# Altium schematic sheet USB.SchDoc
size A4
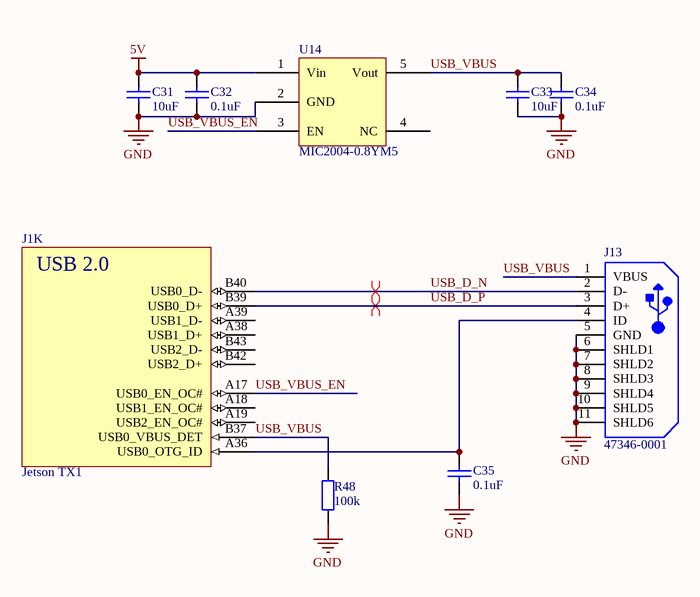
[diagram p0: USB.SchDoc]

## Parts
C31  value 10uF  [0603C_M]  (hidden comment: GRM188R60J106ME47D)
C32  Capacitance: 0.1uF  [0402C_M]  (hidden comment: GRM155R71C104KA88D)
C33  value 10uF  [0603C_M]  (hidden comment: GRM188R60J106ME47D)
C34  Capacitance: 0.1uF  [0402C_M]  (hidden comment: GRM155R71C104KA88D)
C35  Capacitance: 0.1uF  [0402C_M]  (hidden comment: GRM155R71C104KA88D)
J1  Jetson TX1  [Nvidia Jetson TX1]  (part K of 14)
J13  47346-0001  [MOLX-47346-0001-5_V]
R48  Resistance: 100k  [0402R_M]  (hidden comment: CRCW0402100KJNED)
U14  MIC2004-0.8YM5  [SOT23_M5_L]

## Nets
5V: C31.2 C32.2 U14.1(Vin)
GND: C31.1 C32.1 C33.1 C34.1 C35.1 J13.5(GND) J13.6(SHLD1) J13.7(SHLD2) J13.8(SHLD3) J13.9(SHLD4) J13.10(SHLD5) J13.11(SHLD6) R48.1 U14.2(GND)
USB_D_N: J1.B40(USB0_D-) J13.2(D-)
USB_D_P: J1.B39(USB0_D+) J13.3(D+)
USB_VBUS: C33.2 C34.2 J1.B37(USB0_VBUS_DET) J13.1(VBUS) R48.2 U14.5(Vout)
USB_VBUS_EN: J1.A17(USB0_EN_OC#) U14.3(EN)
NetC35_2: C35.2 J1.A36(USB0_OTG_ID) J13.4(ID)

Not connected (* = marked no-connect by the designer): J1 A18(USB1_EN_OC#) A19(USB2_EN_OC#) A38(USB1_D+) A39(USB1_D-) B42(USB2_D+) B43(USB2_D-); U14 4(NC)

## Layout directives
differential pair; net class DIFF90: USB_D_N, USB_D_P

## Notes on the sheet
- (in symbol NVIDIA_Jetson_TX1, part K) USB 2.0

## Library data of the parts
C31 C33 = GRM188R60J106ME47D: CAP CER 10UF 6.3V X5R 0603; Manufacturer: Murata Electronics North America; Tolerance: ±20%; Supplier 1: Digi-Key; Manufacturer Part Number: GRM188R60J106ME47D; RoHS: RoHS Compliant; Category: Capacitors; Stock 1: 13697850; Pricing 1: 1=0.17, 10=0.123, 100=0.0578, 500=0.04052, 1000=0.03355 (USD); Packaging: Cut Tape (CT); Part Status: Active; Voltage - Rated: 6.3V; Temperature Coefficient: X5R; Operating Temperature: -55°C ~ 85°C; Features: -; Ratings: -; Applications: General Purpose; Mounting Type: Surface Mount, MLCC; Package / Case: 0603 (1608 Metric); Size / Dimension: 0.063" L x 0.031" W (1.60mm x 0.80mm); Height - Seated (Max): -; Thickness (Max): 0.035" (0.90mm); Lead Spacing: -; Lead Style: -; ComponentLink1URL: http://www.murata.com/~/media/webrenewal/support/library/catalog/products/capacitor/mlcc/c02e.pdf; ComponentLink1Description: http://www.murata.com/~/media/webrenewal/support/library/catalog/products/capacitor/mlcc/c02e.pdf; Supplier Part Number 1: 490-3896-1-ND
C32 C34 C35 = GRM155R71C104KA88D: CAP CER 0.1UF 16V X7R 0402; Manufacturer: Murata Electronics North America; Tolerance: ±10%; Supplier 1: Digi-Key; Manufacturer Part Number: GRM155R71C104KA88D; RoHS: RoHS Compliant; Category: Capacitors; Stock 1: 58190082; Pricing 1: 1=0.1, 10=0.013, 100=0.0059, 500=0.00422, 1000=0.00332, 2500=0.00302, 5000=0.00278 (USD); Packaging: Cut Tape (CT); Part Status: Active; Voltage - Rated: 16V; Temperature Coefficient: X7R; Operating Temperature: -55°C ~ 125°C; Features: -; Ratings: -; Applications: General Purpose; Mounting Type: Surface Mount, MLCC; Package / Case: 0402 (1005 Metric); Size / Dimension: 0.039" L x 0.020" W (1.00mm x 0.50mm); Height - Seated (Max): -; Thickness (Max): 0.022" (0.55mm); Lead Spacing: -; Lead Style: -; ComponentLink1URL: http://www.murata.com/~/media/webrenewal/support/library/catalog/products/capacitor/mlcc/c02e.ashx; ComponentLink1Description: http://www.murata.com/~/media/webrenewal/support/library/catalog/products/capacitor/mlcc/c02e.ashx; Supplier Part Number 1: 490-3261-1-ND
J1 = NVIDIA_Jetson_TX1: Nvidia computing module
J13 = CMP-2000-05246-1: Micro-USB B Receptacle with Flange, -30 to 85 degC, 5-Pin SMD, RoHS, Tape and Reel; Manufacturer: Molex; Number of Contacts: 5; Body Orientation: RightAngle; Maximum Voltage Rating: 30VAC; Pitch: 0.65mm; Maximum Current Rating: 1.8/ContactA; Number of Ports: 1; Gender: RCP; Operating Temperature: -30to85C; Part No: 47346-0001; Color: Black; Termination Method: Solder; Contact Plating: GoldOverPalladiumNickelOverNickel; Dimension: 7.8x5.43x2.94mm; Number of Terminals: 5; Datasheet Version: Dec-13; Datasheet URL: https://datasheet.ciiva.com/30075/304740473460001-io-nectors-30075527.pdf; Contact Material: CopperAlloy; RoHS: Yes; Housing Material: LiquidCrystalPolymer; Manufacturer URL: http://www.molex.com/; Packaging: EmbossedTapeandReel; Mounting: SurfaceMount; Type: MicroUSBTypeB
R48 = CRCW0402100KJNED: RES SMD 100K OHM 5% 1/16W 0402; Manufacturer: Vishay; Brand: Vishay / Dale; Power Rating: 63 mW; Temperature Coefficient: 200 PPM / K; Voltage Rating: 50 V; Unit Weight: 0.000023 oz; Supplier 1: Digi-Key; Manufacturer Part Number: CRCW0402100KJNED; Stock 1: 174; Pricing 1: 1=0.1, 10=0.025, 100=0.01, 1000=0.0045, 2500=0.0039, 5000=0.0032 (USD); Product Category: Thick Film Resistors - SMD; RoHS: Details; Tolerance: 5 %; Case Code - in: 0402; Case Code - mm: 1005; Operating Temperature Range: - 55 C to + 155 C; Series: CRCW; Height: 0.35 mm; Length: 1 mm; Package / Case: 0402 (1005 metric); Packaging: Reel; Product: Thick Film Resistors SMD; Factory Pack Quantity: 10000; Termination Style: SMD/SMT; Width: 0.5 mm; ComponentLink1URL: https://datasheet.ciiva.com/3255/dcrcwe3-3255949.pdf; ComponentLink1Description: https://datasheet.ciiva.com/3255/dcrcwe3-3255949.pdf; ComponentLink2URL: https://datasheet.ciiva.com/28420/dcrcwe3-28420124.pdf; ComponentLink2Description: https://datasheet.ciiva.com/28420/dcrcwe3-28420124.pdf; ComponentLink3URL: https://datasheet.ciiva.com/3255/dcrcwe3-3255950.pdf; ComponentLink3Description: https://datasheet.ciiva.com/3255/dcrcwe3-3255950.pdf; ComponentLink4URL: https://datasheet.ciiva.com/28621/1847332-28621326.pdf; ComponentLink4Description: https://datasheet.ciiva.com/28621/1847332-28621326.pdf; ComponentLink5URL: https://datasheet.ciiva.com/16763/70201119-16763038.pdf; ComponentLink5Description: https://datasheet.ciiva.com/16763/70201119-16763038.pdf; ComponentLink6URL: https://datasheet.ciiva.com/2461/dcrcwe3-2461990.pdf; ComponentLink6Description: https://datasheet.ciiva.com/2461/dcrcwe3-2461990.pdf; ComponentLink7URL: https://datasheet.ciiva.com/2461/dcrcwe3-2461989.pdf; ComponentLink7Description: https://datasheet.ciiva.com/2461/dcrcwe3-2461989.pdf; ComponentLink8URL: https://datasheet.ciiva.com/2461/dcrcwe3-2461991.pdf; ComponentLink8Description: https://datasheet.ciiva.com/2461/dcrcwe3-2461991.pdf; ComponentLink9URL: https://datasheet.ciiva.com/7777/1533075-7777191.pdf; ComponentLink9Description: https://datasheet.ciiva.com/7777/1533075-7777191.pdf; ComponentLink10URL: https://datasheet.ciiva.com/5552/dcrcwe3-109170-5552439.pdf; ComponentLink10Description: https://datasheet.ciiva.com/5552/dcrcwe3-109170-5552439.pdf; Supplier Part Number 1: 541-100KJDKR-ND
U14 = MIC2004-0.8YM5: IC DISTRIBUTION SW 0.8A SOT23-5; Manufacturer: Microchip Technology; Switch Type: General Purpose; Number of Outputs: 1; Ratio - Input:Output: 1:1; Output Configuration: High Side; Output Type: P-Channel; Interface: On/Off; Voltage - Load: 2.5 V ~ 5.5 V; Voltage - Supply (Vcc/Vdd): Not Required; Current - Output (Max): 800mA; Rds On (Typ): 70 mOhm; Input Type: Non-Inverting; Fault Protection: Current Limiting (Fixed), Over Temperature; Supplier 1: Digi-Key; Manufacturer Part Number: MIC2004-0.8YM5; RoHS: RoHS Compliant; Category: Integrated Circuits (ICs); Stock 1: 0; Pricing 1: 1050=0 (USD); Packaging: Tube; Part Status: Obsolete; Features: Load Discharge; Operating Temperature: -40°C ~ 85°C (TA); Package / Case: SC-74A, SOT-753; Supplier Device Package: SOT-23-5; ComponentLink1URL: http://www.microchip.com/mymicrochip/filehandler.aspx?ddocname=en579487; ComponentLink1Description: http://www.microchip.com/mymicrochip/filehandler.aspx?ddocname=en579487; Supplier Part Number 1: MIC2004-0.8YM5-ND